# Altium schematic sheet MOTOR_DRIVER_CEC.SchDoc
size A4; SheetNumber: 7; SheetTotal: 12
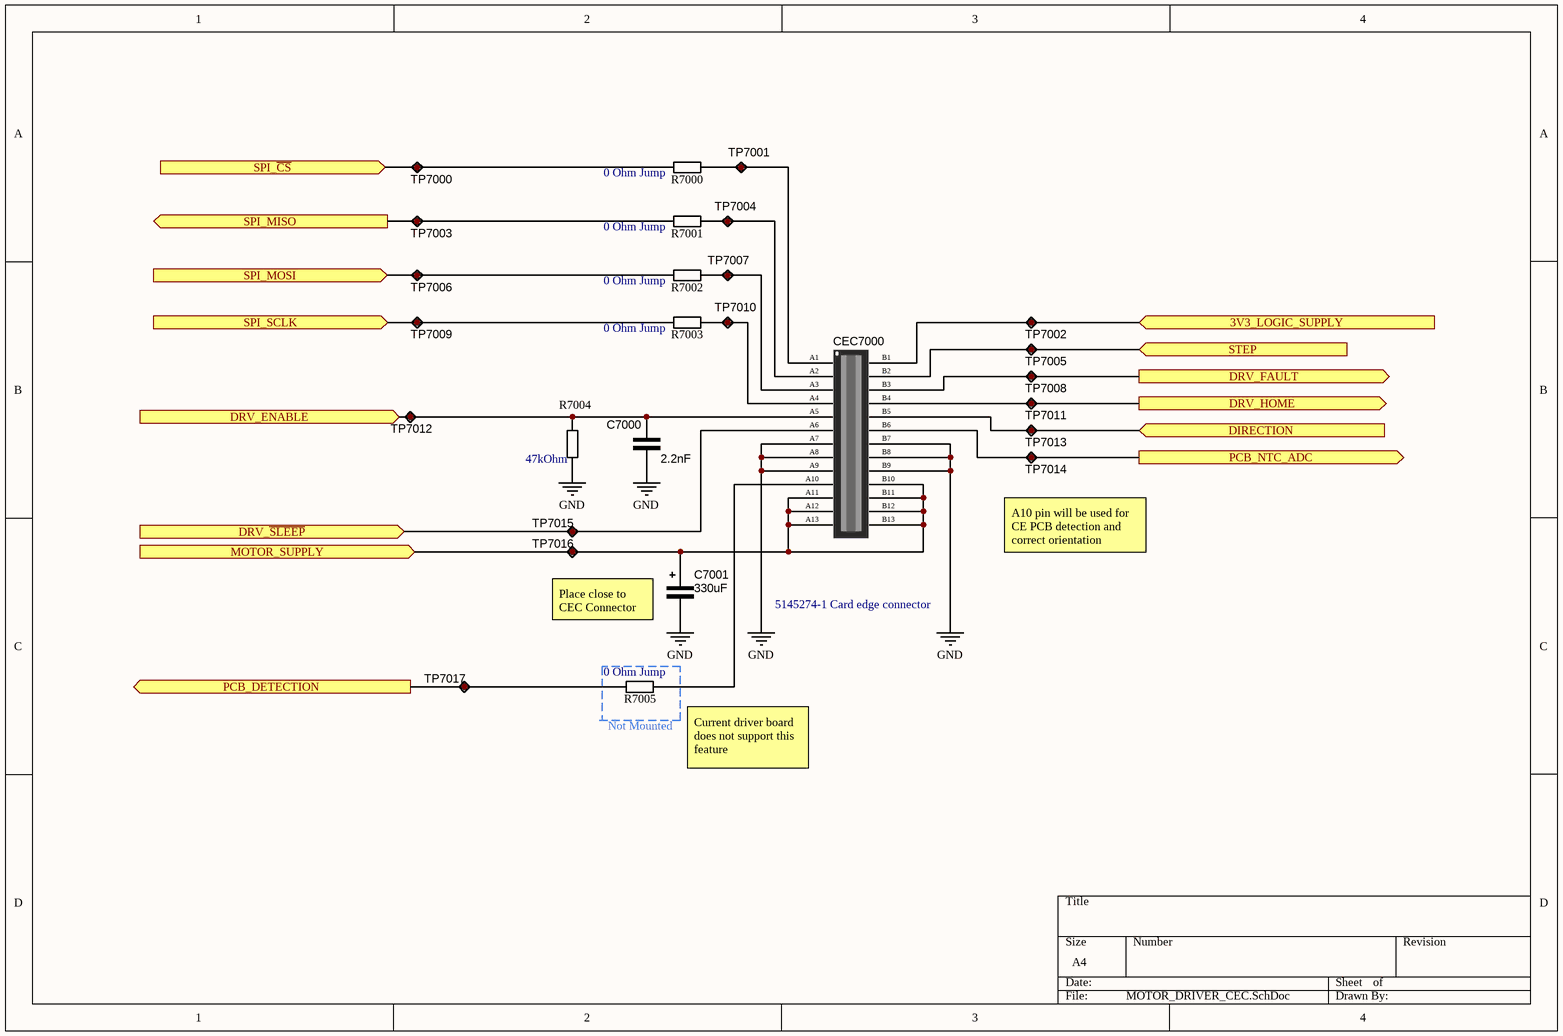
[diagram p0: MOTOR_DRIVER_CEC.SchDoc]

## Parts
C7000  2.2nF  [CAP_0603]
C7001  330uF  [CAPAE109103X103M]
CEC7000  5145274-1 Card edge connector  [5145274-1]
R7000  0 Ohm Jump  [RES_0603]
R7001  0 Ohm Jump  [RES_0603]
R7002  0 Ohm Jump  [RES_0603]
R7003  0 Ohm Jump  [RES_0603]
R7004  47kOhm  [RES_0603]
R7005  0 Ohm Jump  [RES_0603]
TP7000  Test point  [TestPoint]  (value not drawn)
TP7001  Test point  [TestPoint]  (value not drawn)
TP7002  Test point  [TestPoint]  (value not drawn)
TP7003  Test point  [TestPoint]  (value not drawn)
TP7004  Test point  [TestPoint]  (value not drawn)
TP7005  Test point  [TestPoint]  (value not drawn)
TP7006  Test point  [TestPoint]  (value not drawn)
TP7007  Test point  [TestPoint]  (value not drawn)
TP7008  Test point  [TestPoint]  (value not drawn)
TP7009  Test point  [TestPoint]  (value not drawn)
TP7010  Test point  [TestPoint]  (value not drawn)
TP7011  Test point  [TestPoint]  (value not drawn)
TP7012  Test point  [TestPoint]  (value not drawn)
TP7013  Test point  [TestPoint]  (value not drawn)
TP7014  Test point  [TestPoint]  (value not drawn)
TP7015  Test point  [TestPoint]  (value not drawn)
TP7016  Test point  [TestPoint]  (value not drawn)
TP7017  Test point  [TestPoint]  (value not drawn)

## Ports
3V3_LOGIC_SUPPLY (in, see 6DOF_CONTROLLER_Top[11C]), DIRECTION (in, see 6DOF_CONTROLLER_Top[11C]), DRV_ENABLE (in, see 6DOF_CONTROLLER_Top[11C]), DRV_FAULT (out, see 6DOF_CONTROLLER_Top[11C]), DRV_HOME (out, see 6DOF_CONTROLLER_Top[11C]), DRV_~{SLEEP} (in, see 6DOF_CONTROLLER_Top[11C]), MOTOR_SUPPLY (in, see 6DOF_CONTROLLER_Top[11C]), PCB_DETECTION (out, see 6DOF_CONTROLLER_Top[11C]), PCB_NTC_ADC (out, see 6DOF_CONTROLLER_Top[11C]), SPI_MISO (out, see 6DOF_CONTROLLER_Top[11C]), SPI_MOSI (in, see 6DOF_CONTROLLER_Top[11C]), SPI_SCLK (in, see 6DOF_CONTROLLER_Top[11C]), SPI_~{CS} (in, see 6DOF_CONTROLLER_Top[11C]), STEP (in, see 6DOF_CONTROLLER_Top[11C])

## Nets
GND: C7001.1 CEC7000.A7 CEC7000.A8 CEC7000.A9 CEC7000.B7 CEC7000.B8 CEC7000.B9
3V3_LOGIC_SUPPLY: CEC7000.B1 TP7002.1 ; port 3V3_LOGIC_SUPPLY
DIRECTION: CEC7000.B5 TP7013.1 ; port DIRECTION
DRV_ENABLE: C7000.2 CEC7000.A5 R7004.2 TP7012.1 ; port DRV_ENABLE
DRV_FAULT: CEC7000.B3 TP7008.1 ; port DRV_FAULT
DRV_HOME: CEC7000.B4 TP7011.1 ; port DRV_HOME
DRV_~{SLEEP}: CEC7000.A6 TP7015.1 ; port DRV_~{SLEEP}
MOTOR_SUPPLY: C7001.2 CEC7000.A11 CEC7000.A12 CEC7000.A13 CEC7000.B10 CEC7000.B11 CEC7000.B12 CEC7000.B13 TP7016.1 ; port MOTOR_SUPPLY
PCB_DETECTION: R7005.1 TP7017.1 ; port PCB_DETECTION
PCB_NTC_ADC: CEC7000.B6 TP7014.1 ; port PCB_NTC_ADC
SPI_~{CS}: R7000.1 TP7000.1 ; port SPI_~{CS}
SPI_MISO: R7001.1 TP7003.1 ; port SPI_MISO
SPI_MOSI: R7002.1 TP7006.1 ; port SPI_MOSI
SPI_SCLK: R7003.1 TP7009.1 ; port SPI_SCLK
STEP: CEC7000.B2 TP7005.1 ; port STEP
NetCEC7000_A1: CEC7000.A1 R7000.2 TP7001.1
NetCEC7000_A2: CEC7000.A2 R7001.2 TP7004.1
NetCEC7000_A3: CEC7000.A3 R7002.2 TP7007.1
NetCEC7000_A4: CEC7000.A4 R7003.2 TP7010.1
NetCEC7000_A10: CEC7000.A10 R7005.2

Not connected (* = marked no-connect by the designer): C7000 1; R7004 1

## Notes on the sheet
- (near TP7014) A10 pin will be used for CE PCB detection and correct orientation
- Place close to CEC Connector
- (near R7005) Not Mounted
- (near R7005) Current driver board does not support this feature
- Labels drawn without touching a wire or pin: GND

## Library data of the parts
C7000 = C000006: 2200 pF ±10% 25V Ceramic Capacitor X7R 0603 (1608 Metric); ComponentLink1Description: DigiKey; ComponentLink1URL: https://www.digikey.com/en/products/detail/yageo/CC0603KRX7R8BB222/2345066; DigiKey Part Number: 311-3653-1-ND; capacitance: 2.2nF
C7001 = C000026: 330 µF 50 V Aluminum Electrolytic Capacitors Radial, Can - SMD 120mOhm @ 100kHz 2000 Hrs @ 105°C; ComponentLink1Description: DigiKey; ComponentLink1URL: https://www.digikey.com/en/products/detail/chemi-con/EMZR500ARA331MJA0G/5824768; DigiKey Part Number: 565-EMZR500ARA331MJA0GCT-ND; capacitance: 330uF
CEC7000 = 00000012: 26 Position Female Connector Non Specified - Dual Edge Gold 0.100" (2.54mm) Black; DigiKey Part Number: 5145274-1-ND; Mouser Part Number: 571-5145274-1; ComponentLink1Description: DigiKey; ComponentLink1URL: https://www.digikey.com/en/products/detail/te-connectivity-amp-connectors/5145274-1/1122000?s=N4IgTCBcDaIKwEYAscwHYkFoEgLoF8g; ComponentLink2Description: Mouser; ComponentLink2URL: https://eu.mouser.com/ProductDetail/TE-Connectivity/5145274-1?qs=2yE%2FVfFfKwpybi4w6sCxTA%3D%3D
R7000-R7003 R7005 = R000007: 0 Ohms Jumper Chip Resistor 0603 (1608 Metric) Automotive AEC-Q200 Thick Film; ComponentLink1Description: DigiKey; ComponentLink1URL: https://www.digikey.com/en/products/detail/stackpole-electronics-inc/RMCF0603ZT0R00/1756908; resistance: 0 Ohm Jump; DigiKey Part Number: RMCF0603ZT0R00CT-ND
R7004 = R000010: 47 kOhms ±1% 0.1W, 1/10W Chip Resistor 0603 (1608 Metric) Moisture Resistant Thick Film; ComponentLink1Description: DigiKey; ComponentLink1URL: https://www.digikey.com/en/products/detail/yageo/RC0603FR-0747KL/727253; resistance: 47kOhm; DigiKey Part Number: 311-47.0KHRCT-ND
TP7000-TP7017 = TP002: Test point 1mm